# EAGLE schematic fc-carrier (EAGLE 5.09)
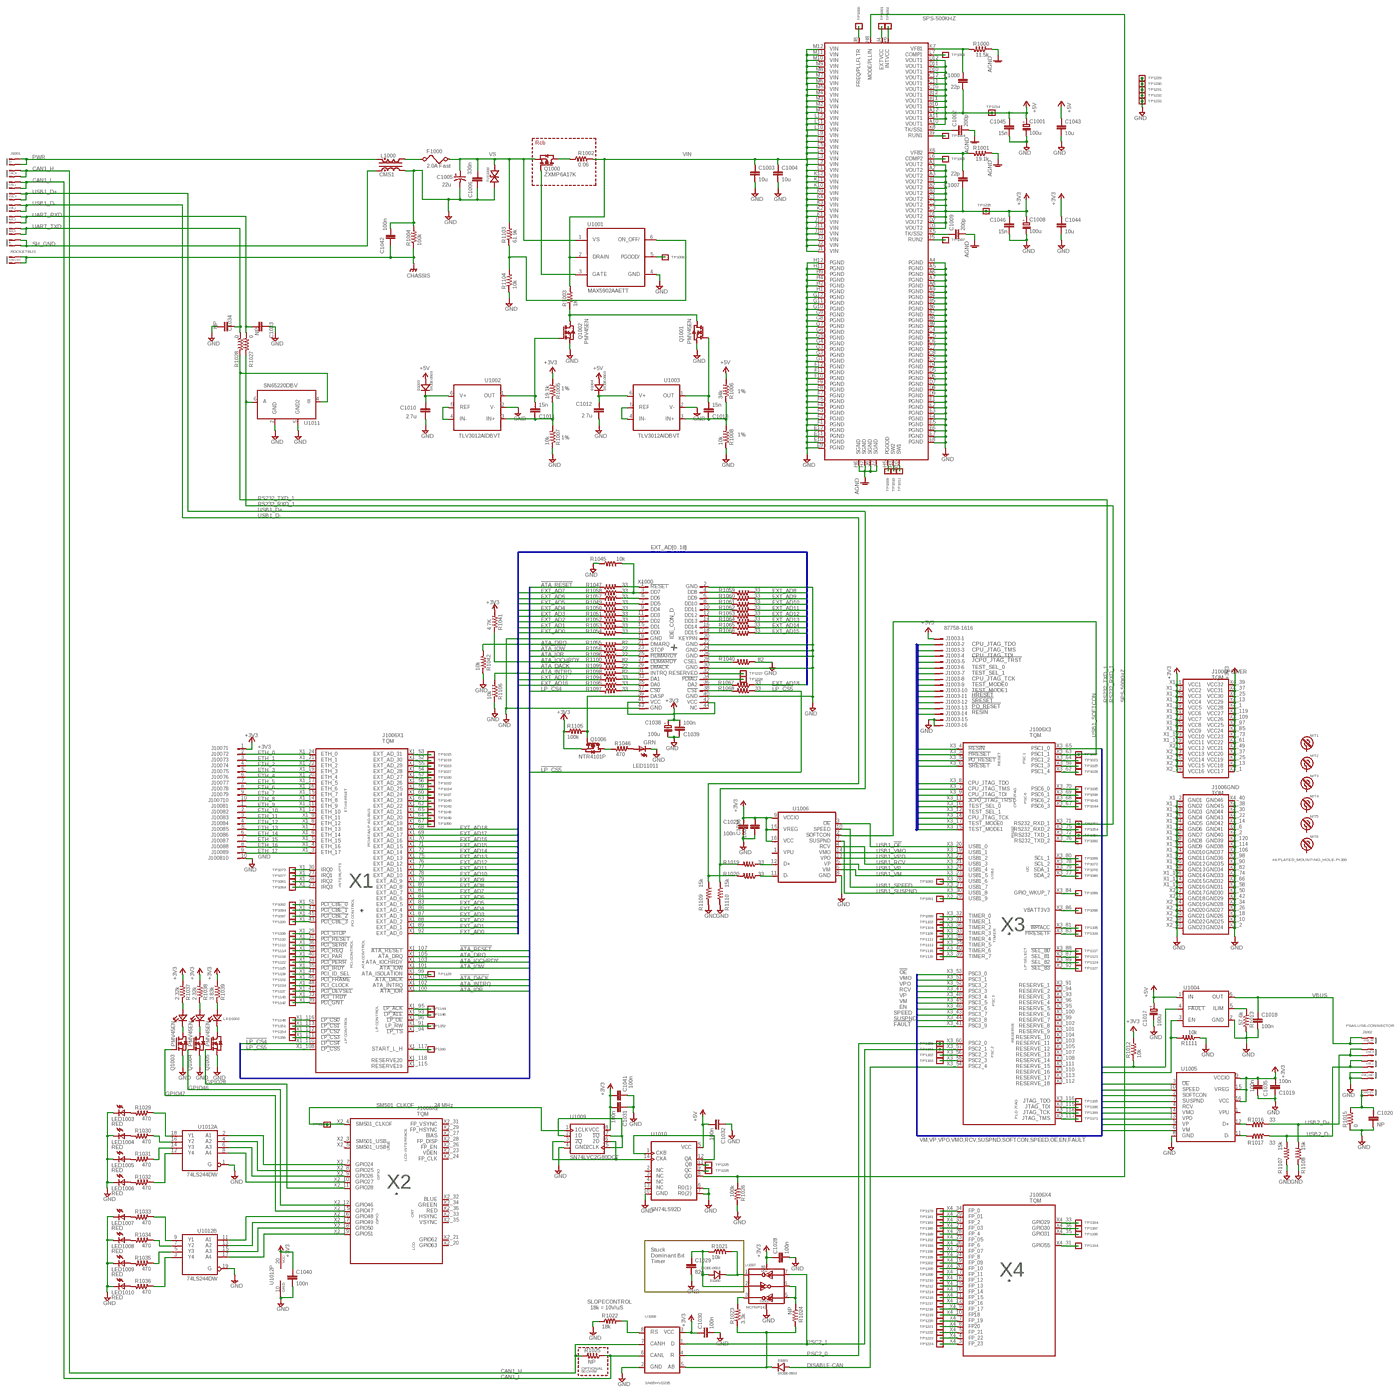
[diagram p0: schematic, sheet 1, overview]
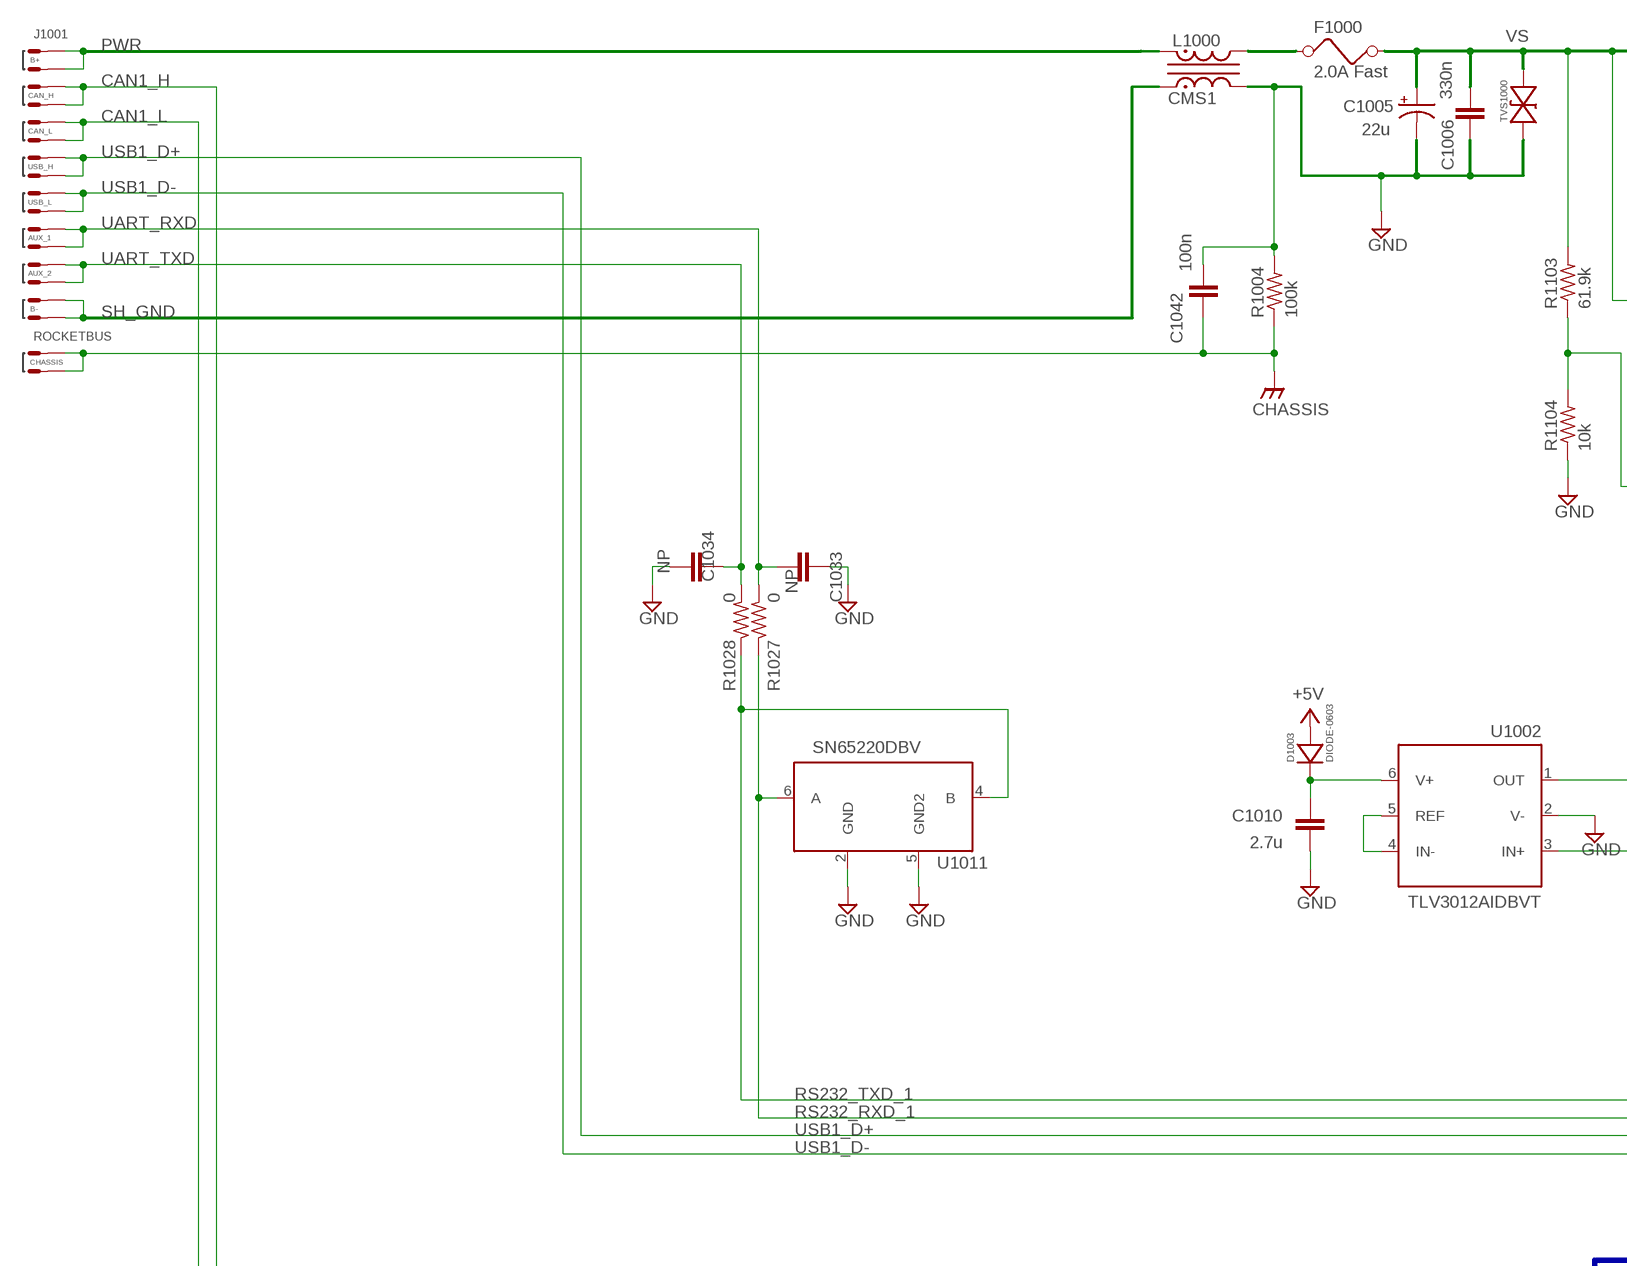
[diagram p1: schematic, sheet 1, part 1 of 4]
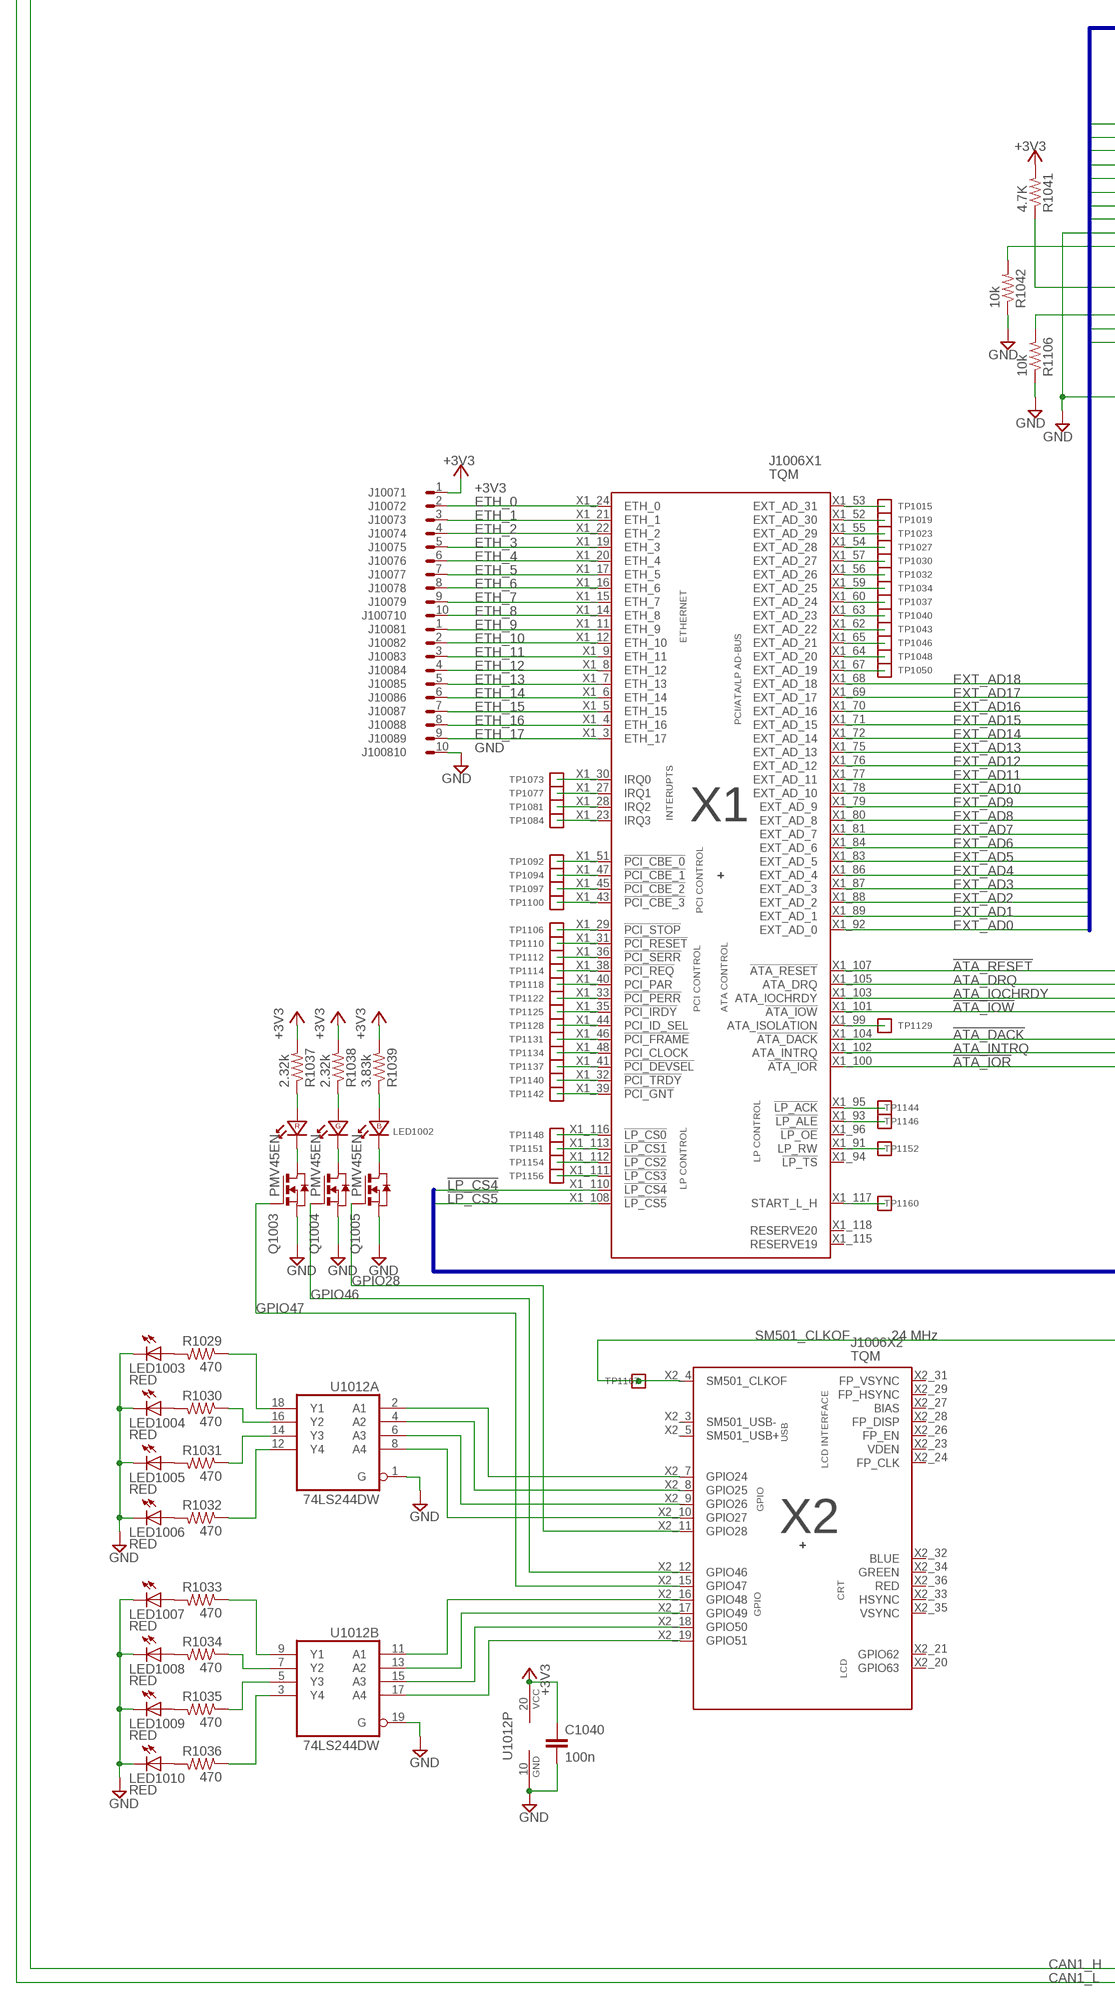
[diagram p2: schematic, sheet 1, part 2 of 4]
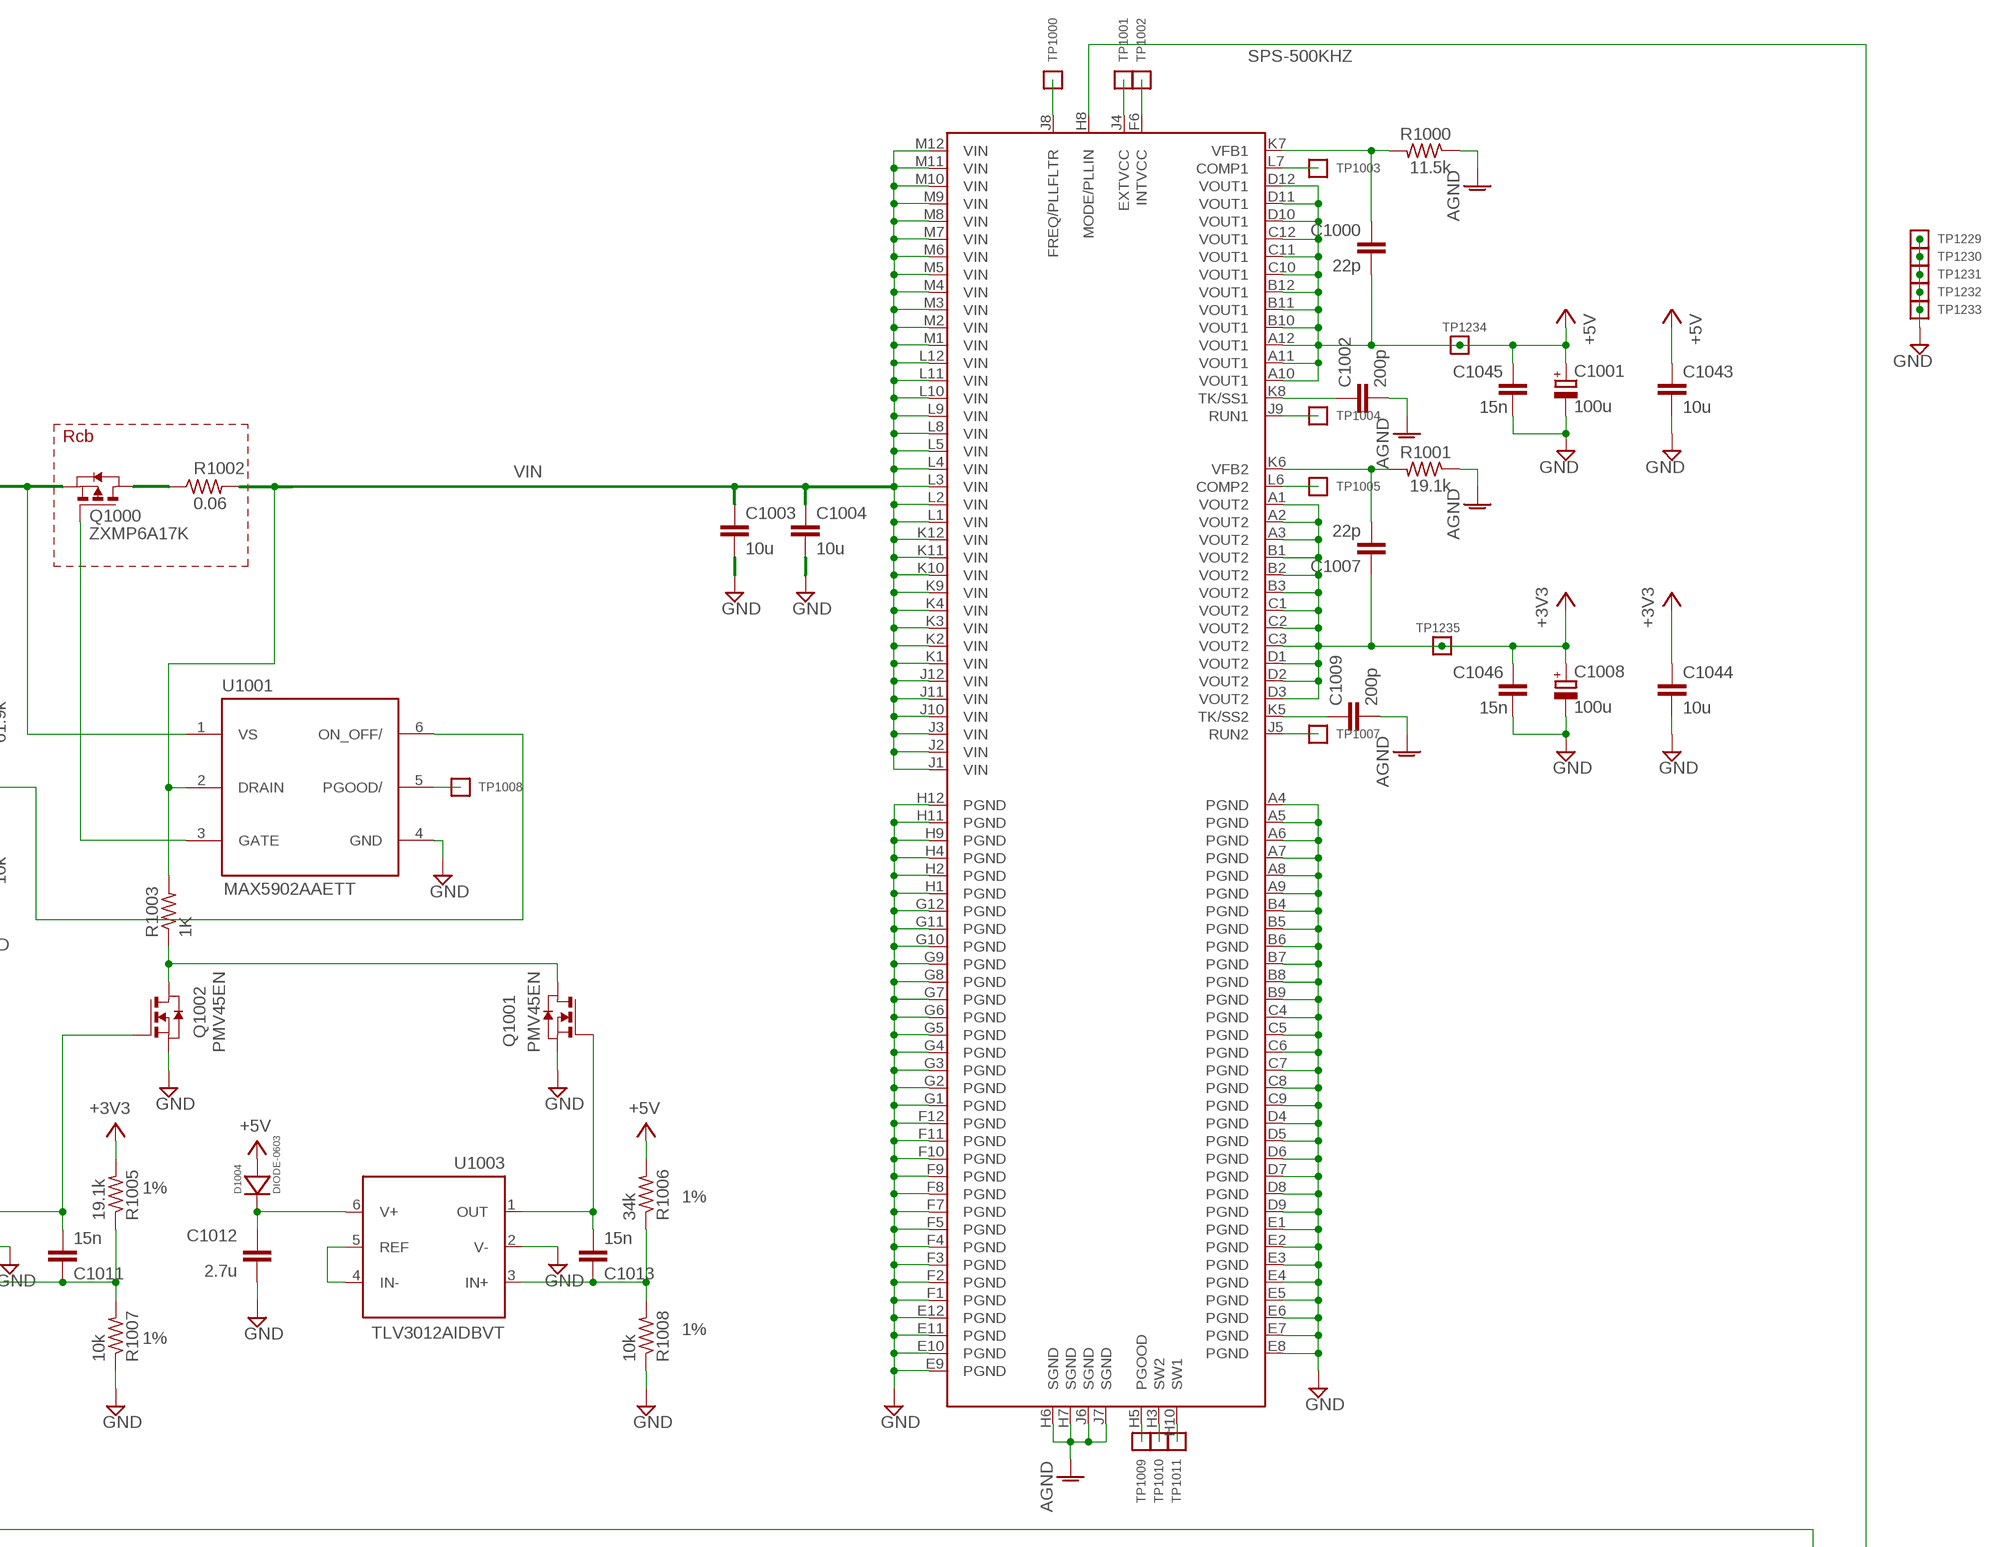
[diagram p3: schematic, sheet 1, part 3 of 4]
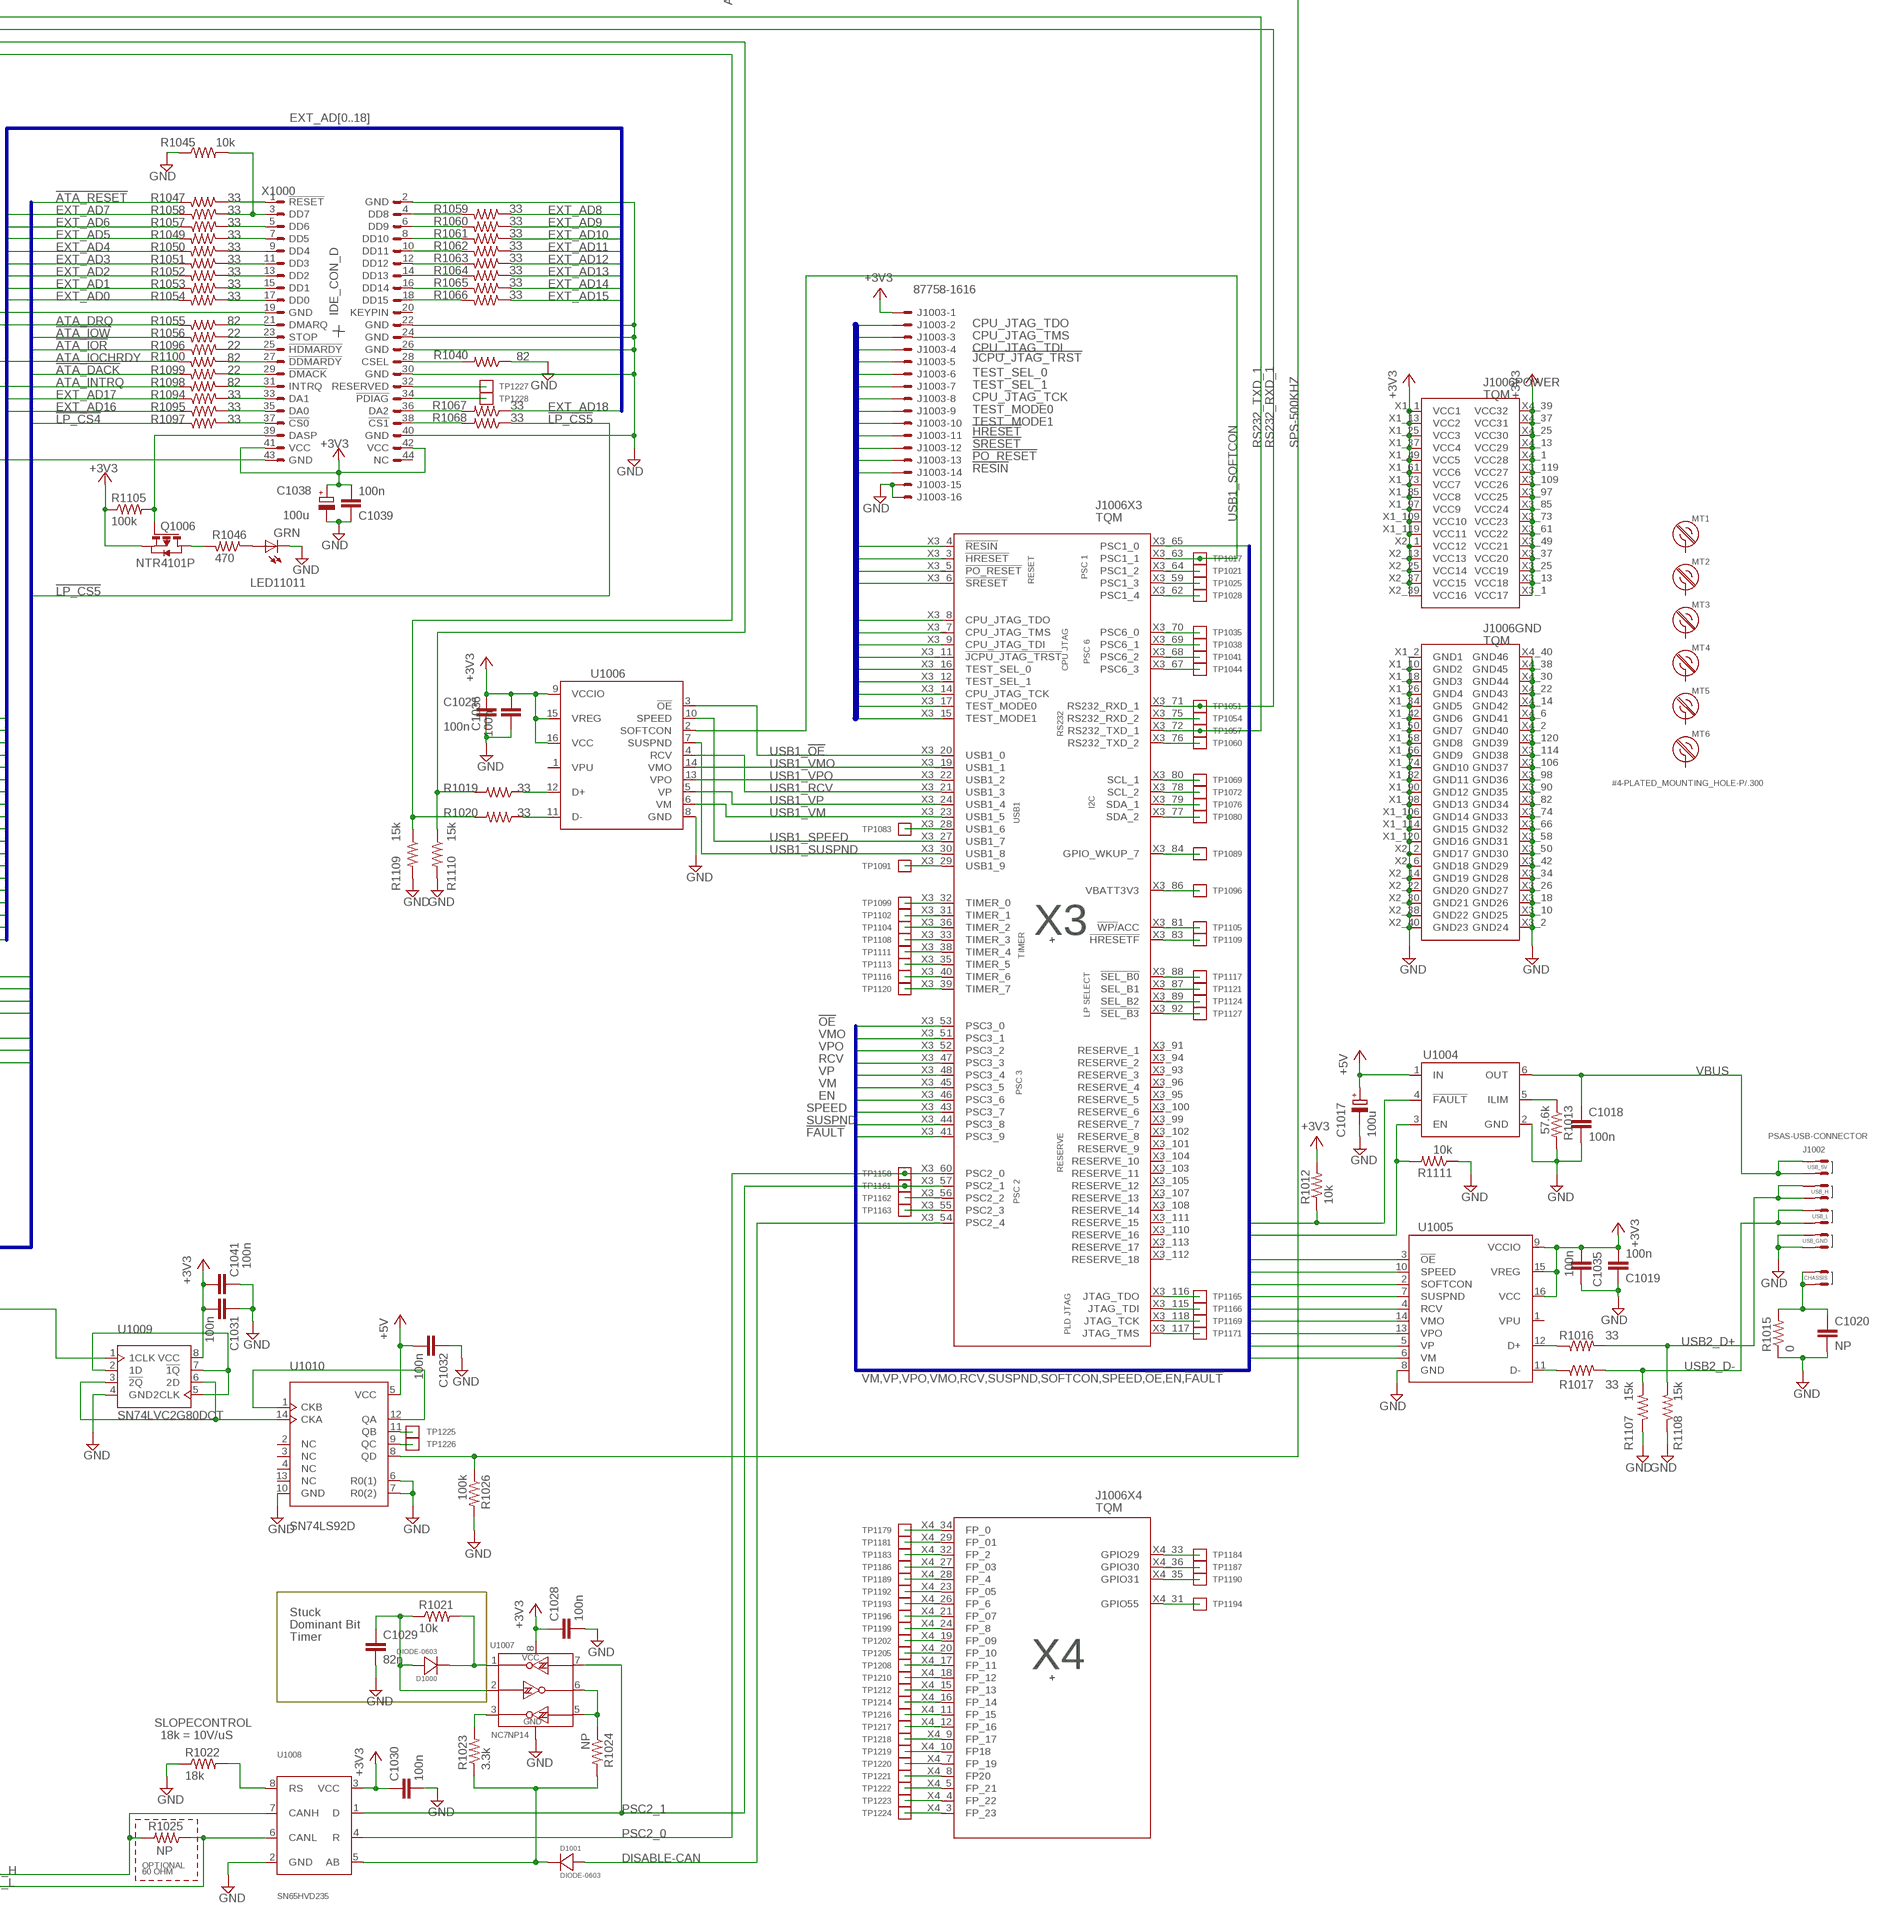
[diagram p4: schematic, sheet 1, part 4 of 4]

## Parts
C1000  22p  C-EU0603-B-NOSILK  [0603-B-NOSILK]
C1001  100u  CPOL-EUD/7343-31R  [D/7343-31R]
C1002  200p  C-EU0603-B-NOSILK  [0603-B-NOSILK]
C1003  10u  C-EU0805-B-NOSILK  [0805-B-NOSILK]
C1004  10u  C-EU0805-B-NOSILK  [0805-B-NOSILK]
C1005  22u  CPOL-USD/7343-31R  [D/7343-31R]
C1006  330n  C-EU0805-B-NOSILK  [0805-B-NOSILK]
C1007  22p  C-EU0603-B-NOSILK  [0603-B-NOSILK]
C1008  100u  CPOL-EUD/7343-31R  [D/7343-31R]
C1009  200p  C-EU0603-B-NOSILK  [0603-B-NOSILK]
C1010  2.7u  C-EU0603-B-NOSILK  [0603-B-NOSILK]
C1011  15n  C-EU0603-B-NOSILK  [0603-B-NOSILK]
C1012  2.7u  C-EU0603-B-NOSILK  [0603-B-NOSILK]
C1013  15n  C-EU0603-B-NOSILK  [0603-B-NOSILK]
C1017  100u  CPOL-EUD/7343-31R  [D/7343-31R]
C1018  100n  C-EU0603-B-NOSILK  [0603-B-NOSILK]
C1019  100n  C-EU0603-B-NOSILK  [0603-B-NOSILK]
C1020  NP  C-EU0603-B-NOSILK  [0603-B-NOSILK]
C1021  100n  C-EU0603-B-NOSILK  [0603-B-NOSILK]
C1028  100n  C-EU0603-B-NOSILK  [0603-B-NOSILK]
C1029  82n  C-EU0603-B-NOSILK  [0603-B-NOSILK]
C1030  100n  C-EU0603-B-NOSILK  [0603-B-NOSILK]
C1031  100n  C-EU0603-B-NOSILK  [0603-B-NOSILK]
C1032  100n  C-EU0603-B-NOSILK  [0603-B-NOSILK]
C1033  NP  C-EU0603-B-NOSILK  [0603-B-NOSILK]
C1034  NP  C-EU0603-B-NOSILK  [0603-B-NOSILK]
C1035  100n  C-EU0603-B-NOSILK  [0603-B-NOSILK]
C1036  100n  C-EU0603-B-NOSILK  [0603-B-NOSILK]
C1038  100u  CPOL-EUD/7343-31R  [D/7343-31R]
C1039  100n  C-EU0603-B-NOSILK  [0603-B-NOSILK]
C1040  100n  C-EU0603-B-NOSILK  [0603-B-NOSILK]
C1041  100n  C-EU0603-B-NOSILK  [0603-B-NOSILK]
C1042  100n  C-EU0603-B-NOSILK  [0603-B-NOSILK]
C1043  10u  C-EU0805-B-NOSILK  [0805-B-NOSILK]
C1044  10u  C-EU0805-B-NOSILK  [0805-B-NOSILK]
C1045  15n  C-EU0603-B-NOSILK  [0603-B-NOSILK]
C1046  15n  C-EU0603-B-NOSILK  [0603-B-NOSILK]
D1000  DIODE-0603  [0603-B-NOSILK-DIODE]
D1001  DIODE-0603  [0603-B-NOSILK-DIODE]
D1003  DIODE-0603  [0603-B-NOSILK-DIODE]
D1004  DIODE-0603  [0603-B-NOSILK-DIODE]
F1000  2.0A Fast  FUSE1206  [1206]
J1001  ROCKETBUS  [ROCKETBUS-PKG]
J1002  PSAS-USB-CONNECTOR  [USB-CONNECTOR-PKG]
J1003  87758-1616  [87758-1616]
J1006  TQM  [TQM]
J1007  1_10_CON  [1_10_CON]
J1008  1_10_CON  [1_10_CON]
L1000  CMS1  COIL_CMS1  [CMS1]
LED1002  RGB  LED_RGB_PLCC-6  [PLCC-6]
LED1003  RED  LEDCHIPLED_0603  [CHIPLED_0603]
LED1004  RED  LEDCHIPLED_0603  [CHIPLED_0603]
LED1005  RED  LEDCHIPLED_0603  [CHIPLED_0603]
LED1006  RED  LEDCHIPLED_0603  [CHIPLED_0603]
LED1007  RED  LEDCHIPLED_0603  [CHIPLED_0603]
LED1008  RED  LEDCHIPLED_0603  [CHIPLED_0603]
LED1009  RED  LEDCHIPLED_0603  [CHIPLED_0603]
LED1010  RED  LEDCHIPLED_0603  [CHIPLED_0603]
LED11011  GRN  LEDCHIPLED_0603  [CHIPLED_0603]
MT1  #4-PLATED_MOUNTING_HOLE-P/.300  [#4/.225-PAD+HEAD_OR_SMALL_NUT]
MT2  #4-PLATED_MOUNTING_HOLE-P/.300  [#4/.225-PAD+HEAD_OR_SMALL_NUT]
MT3  #4-PLATED_MOUNTING_HOLE-P/.300  [#4/.225-PAD+HEAD_OR_SMALL_NUT]
MT4  #4-PLATED_MOUNTING_HOLE-P/.300  [#4/.225-PAD+HEAD_OR_SMALL_NUT]
MT5  #4-PLATED_MOUNTING_HOLE-P/.300  [#4/.225-PAD+HEAD_OR_SMALL_NUT]
MT6  #4-PLATED_MOUNTING_HOLE-P/.300  [#4/.225-PAD+HEAD_OR_SMALL_NUT]
Q1000  ZXMP6A17K  [DPAK-ZETEX]
Q1001  PMV45EN  [SOT23]
Q1002  PMV45EN  [SOT23]
Q1003  PMV45EN  [SOT23]
Q1004  PMV45EN  [SOT23]
Q1005  PMV45EN  [SOT23]
Q1006  NTR4101P  [SOT23]
R1000  11.5k  R-US_0603-B-NOSILK  [0603-B-NOSILK]
R1001  19.1k  R-US_0603-B-NOSILK  [0603-B-NOSILK]
R1002  0.06  R-US_0805-B-NOSILK  [0805-B-NOSILK]
R1003  1K  R-US_0603-B-NOSILK  [0603-B-NOSILK]
R1004  100k  R-US_0603-B-NOSILK  [0603-B-NOSILK]
R1005  19.1k  R-US_0603-B-NOSILK  [0603-B-NOSILK]
R1006  34k  R-US_0603-B-NOSILK  [0603-B-NOSILK]
R1007  10k  R-US_0603-B-NOSILK  [0603-B-NOSILK]
R1008  10k  R-US_0603-B-NOSILK  [0603-B-NOSILK]
R1012  10k  R-US_0603-B-NOSILK  [0603-B-NOSILK]
R1013  57.6k  R-US_0603-B-NOSILK  [0603-B-NOSILK]
R1015  0  R-US_0603-B-NOSILK  [0603-B-NOSILK]
R1016  33  R-US_0603-B-NOSILK  [0603-B-NOSILK]
R1017  33  R-US_0603-B-NOSILK  [0603-B-NOSILK]
R1019  33  R-US_0603-B-NOSILK  [0603-B-NOSILK]
R1020  33  R-US_0603-B-NOSILK  [0603-B-NOSILK]
R1021  10k  R-US_0603-B-NOSILK  [0603-B-NOSILK]
R1022  18k  R-US_0603-B-NOSILK  [0603-B-NOSILK]
R1023  3.3k  R-US_0603-B-NOSILK  [0603-B-NOSILK]
R1024  NP  R-US_0603-B-NOSILK  [0603-B-NOSILK]
R1025  NP  R-US_0603-B-NOSILK  [0603-B-NOSILK]
R1026  100k  R-US_0603-B-NOSILK  [0603-B-NOSILK]
R1027  0  R-US_0603-B-NOSILK  [0603-B-NOSILK]
R1028  0  R-US_0603-B-NOSILK  [0603-B-NOSILK]
R1029  470  R-US_0603-B-NOSILK  [0603-B-NOSILK]
R1030  470  R-US_0603-B-NOSILK  [0603-B-NOSILK]
R1031  470  R-US_0603-B-NOSILK  [0603-B-NOSILK]
R1032  470  R-US_0603-B-NOSILK  [0603-B-NOSILK]
R1033  470  R-US_0603-B-NOSILK  [0603-B-NOSILK]
R1034  470  R-US_0603-B-NOSILK  [0603-B-NOSILK]
R1035  470  R-US_0603-B-NOSILK  [0603-B-NOSILK]
R1036  470  R-US_0603-B-NOSILK  [0603-B-NOSILK]
R1037  2.32k  R-US_0603-B-NOSILK  [0603-B-NOSILK]
R1038  2.32k  R-US_0603-B-NOSILK  [0603-B-NOSILK]
R1039  3.83k  R-US_0603-B-NOSILK  [0603-B-NOSILK]
R1040  82  R-US_0603-B-NOSILK  [0603-B-NOSILK]
R1041  4.7K  R-US_0603-B-NOSILK  [0603-B-NOSILK]
R1042  10k  R-US_0603-B-NOSILK  [0603-B-NOSILK]
R1045  10k  R-US_0603-B-NOSILK  [0603-B-NOSILK]
R1046  470  R-US_0603-B-NOSILK  [0603-B-NOSILK]
R1047  33  R-US_0603-B-NOSILK  [0603-B-NOSILK]
R1049  33  R-US_0603-B-NOSILK  [0603-B-NOSILK]
R1050  33  R-US_0603-B-NOSILK  [0603-B-NOSILK]
R1051  33  R-US_0603-B-NOSILK  [0603-B-NOSILK]
R1052  33  R-US_0603-B-NOSILK  [0603-B-NOSILK]
R1053  33  R-US_0603-B-NOSILK  [0603-B-NOSILK]
R1054  33  R-US_0603-B-NOSILK  [0603-B-NOSILK]
R1055  82  R-US_0603-B-NOSILK  [0603-B-NOSILK]
R1056  22  R-US_0603-B-NOSILK  [0603-B-NOSILK]
R1057  33  R-US_0603-B-NOSILK  [0603-B-NOSILK]
R1058  33  R-US_0603-B-NOSILK  [0603-B-NOSILK]
R1059  33  R-US_0603-B-NOSILK  [0603-B-NOSILK]
R1060  33  R-US_0603-B-NOSILK  [0603-B-NOSILK]
R1061  33  R-US_0603-B-NOSILK  [0603-B-NOSILK]
R1062  33  R-US_0603-B-NOSILK  [0603-B-NOSILK]
R1063  33  R-US_0603-B-NOSILK  [0603-B-NOSILK]
R1064  33  R-US_0603-B-NOSILK  [0603-B-NOSILK]
R1065  33  R-US_0603-B-NOSILK  [0603-B-NOSILK]
R1066  33  R-US_0603-B-NOSILK  [0603-B-NOSILK]
R1067  33  R-US_0603-B-NOSILK  [0603-B-NOSILK]
R1068  33  R-US_0603-B-NOSILK  [0603-B-NOSILK]
R1094  33  R-US_0603-B-NOSILK  [0603-B-NOSILK]
R1095  33  R-US_0603-B-NOSILK  [0603-B-NOSILK]
R1096  22  R-US_0603-B-NOSILK  [0603-B-NOSILK]
R1097  33  R-US_0603-B-NOSILK  [0603-B-NOSILK]
R1098  82  R-US_0603-B-NOSILK  [0603-B-NOSILK]
R1099  22  R-US_0603-B-NOSILK  [0603-B-NOSILK]
R1100  82  R-US_0603-B-NOSILK  [0603-B-NOSILK]
R1103  61.9k  R-US_0603-B-NOSILK  [0603-B-NOSILK]
R1104  10k  R-US_0603-B-NOSILK  [0603-B-NOSILK]
R1105  100k  R-US_0603-B-NOSILK  [0603-B-NOSILK]
R1106  10k  R-US_0603-B-NOSILK  [0603-B-NOSILK]
R1107  15k  R-US_0603-B-NOSILK  [0603-B-NOSILK]
R1108  15k  R-US_0603-B-NOSILK  [0603-B-NOSILK]
R1109  15k  R-US_0603-B-NOSILK  [0603-B-NOSILK]
R1110  15k  R-US_0603-B-NOSILK  [0603-B-NOSILK]
R1111  10k  R-US_0603-B-NOSILK  [0603-B-NOSILK]
TP1000  TEST  [TEST]
TP1001  TEST  [TEST]
TP1002  TEST  [TEST]
TP1003  TEST  [TEST]
TP1004  TEST  [TEST]
TP1005  TEST  [TEST]
TP1007  TEST  [TEST]
TP1008  TEST  [TEST]
TP1009  TEST  [TEST]
TP1010  TEST  [TEST]
TP1011  TEST  [TEST]
TP1015  TEST  [TEST]
TP1017  TEST  [TEST]
TP1019  TEST  [TEST]
TP1021  TEST  [TEST]
TP1023  TEST  [TEST]
TP1025  TEST  [TEST]
TP1027  TEST  [TEST]
TP1028  TEST  [TEST]
TP1030  TEST  [TEST]
TP1032  TEST  [TEST]
TP1034  TEST  [TEST]
TP1035  TEST  [TEST]
TP1037  TEST  [TEST]
TP1038  TEST  [TEST]
TP1040  TEST  [TEST]
TP1041  TEST  [TEST]
TP1043  TEST  [TEST]
TP1044  TEST  [TEST]
TP1046  TEST  [TEST]
TP1048  TEST  [TEST]
TP1050  TEST  [TEST]
TP1051  TEST  [TEST]
TP1054  TEST  [TEST]
TP1057  TEST  [TEST]
TP1060  TEST  [TEST]
TP1069  TEST  [TEST]
TP1072  TEST  [TEST]
TP1073  TEST  [TEST]
TP1076  TEST  [TEST]
TP1077  TEST  [TEST]
TP1080  TEST  [TEST]
TP1081  TEST  [TEST]
TP1083  TEST  [TEST]
TP1084  TEST  [TEST]
TP1089  TEST  [TEST]
TP1091  TEST  [TEST]
TP1092  TEST  [TEST]
TP1094  TEST  [TEST]
TP1096  TEST  [TEST]
TP1097  TEST  [TEST]
TP1099  TEST  [TEST]
TP1100  TEST  [TEST]
TP1102  TEST  [TEST]
TP1104  TEST  [TEST]
TP1105  TEST  [TEST]
TP1106  TEST  [TEST]
TP1108  TEST  [TEST]
TP1109  TEST  [TEST]
TP1110  TEST  [TEST]
TP1111  TEST  [TEST]
TP1112  TEST  [TEST]
TP1113  TEST  [TEST]
TP1114  TEST  [TEST]
TP1116  TEST  [TEST]
TP1117  TEST  [TEST]
TP1118  TEST  [TEST]
TP1120  TEST  [TEST]
TP1121  TEST  [TEST]
TP1122  TEST  [TEST]
TP1124  TEST  [TEST]
TP1125  TEST  [TEST]
TP1127  TEST  [TEST]
TP1128  TEST  [TEST]
TP1129  TEST  [TEST]
TP1131  TEST  [TEST]
TP1134  TEST  [TEST]
TP1137  TEST  [TEST]
TP1140  TEST  [TEST]
TP1142  TEST  [TEST]
TP1144  TEST  [TEST]
TP1146  TEST  [TEST]
TP1148  TEST  [TEST]
TP1151  TEST  [TEST]
TP1152  TEST  [TEST]
TP1154  TEST  [TEST]
TP1156  TEST  [TEST]
TP1158  TEST  [TEST]
TP1160  TEST  [TEST]
TP1161  TEST  [TEST]
TP1162  TEST  [TEST]
TP1163  TEST  [TEST]
TP1165  TEST  [TEST]
TP1166  TEST  [TEST]
TP1167  TEST  [TEST]
TP1169  TEST  [TEST]
TP1171  TEST  [TEST]
TP1179  TEST  [TEST]
TP1181  TEST  [TEST]
TP1183  TEST  [TEST]
TP1184  TEST  [TEST]
TP1186  TEST  [TEST]
TP1187  TEST  [TEST]
TP1189  TEST  [TEST]
TP1190  TEST  [TEST]
TP1192  TEST  [TEST]
TP1193  TEST  [TEST]
TP1194  TEST  [TEST]
TP1196  TEST  [TEST]
TP1199  TEST  [TEST]
TP1202  TEST  [TEST]
TP1205  TEST  [TEST]
TP1208  TEST  [TEST]
TP1210  TEST  [TEST]
TP1212  TEST  [TEST]
TP1214  TEST  [TEST]
TP1216  TEST  [TEST]
TP1217  TEST  [TEST]
TP1218  TEST  [TEST]
TP1219  TEST  [TEST]
TP1220  TEST  [TEST]
TP1221  TEST  [TEST]
TP1222  TEST  [TEST]
TP1223  TEST  [TEST]
TP1224  TEST  [TEST]
TP1225  TEST  [TEST]
TP1226  TEST  [TEST]
TP1227  TEST  [TEST]
TP1228  TEST  [TEST]
TP1229  TEST  [TEST]
TP1230  TEST  [TEST]
TP1231  TEST  [TEST]
TP1232  TEST  [TEST]
TP1233  TEST  [TEST]
TP1234  TEST  [TEST]
TP1235  TEST  [TEST]
TVS1000  TVS-0603  [0603-B-NOSILK-DIODE]
U1000  LT4619  [LT4619]
U1001  MAX5902AAETT  IC_MAX5902  [SOT23-6]
U1002  TLV3012AIDBVT  IC_TLV3012  [SOT23-6]
U1003  TLV3012AIDBVT  IC_TLV3012  [SOT23-6]
U1004  TPS2552SOP  [USB_PWR_SWT_SOP]
U1005  TUSB1106TSSOP  [USB_TRANCEIVER]
U1006  TUSB1106TSSOP  [USB_TRANCEIVER]
U1007  NC7NP14  IC_NC7NP14  [MICROPAK-8]
U1008  SN65HVD235  [DR-PDSO-G8]
U1009  SN74LVC2G80DCT  [DCT-SSOP]
U1010  SN74LS92D  [TI-D-SSOIC]
U1011  SN65220DBV  [SOT23-6L]
U1012  74LS244DW  [SO20W]
X1000  IDE_CON_D  [IDE_CON_P]

## Nets
!ATA_DACK: J1006.X1_104(X1:!ATA_DACK) R1099.2
!ATA_IOR: J1006.X1_100(X1:!ATA_IOR) R1096.1
!ATA_IOW: J1006.X1_101(X1:!ATA_IOW) R1056.2
!ATA_RESET: J1006.X1_107(X1:!ATA_RESET) R1047.2
!CS0: J1006.X3_32(X3:TIMER_0) TP1099.P$1
!CS1: J1006.X3_31(X3:TIMER_1) TP1102.P$1
!FAULT: J1006.X3_41(X3:PSC3_9) R1012.1 U1004.4(!FAULT)
!HRESET: J1003.11 J1006.X3_3(X3:!HRESET)
!JCPU_JTAG_TRST: J1003.5 J1006.X3_11(X3:!JCPU_JTAG_TRST)
!LP_CS4: J1006.X1_110(X1:!LP_CS4) R1097.1
!LP_CS5: J1006.X1_108(X1:!LP_CS5) R1068.1
!OE: J1006.X3_53(X3:PSC3_0) U1005.3(!OE)
!PO_RESET: J1003.13 J1006.X3_5(X3:!PO_RESET)
!RESIN: J1003.14 J1006.X3_4(X3:!RESIN)
!SRESET: J1003.12 J1006.X3_6(X3:!SRESET)
+3V3: C1007.1 C1008.+ C1019.2 C1021.2 C1028.1 C1030.1 C1031.2 C1035.1 C1036.1 C1038.+ C1039.2 C1040.1 C1041.2 C1044.1 C1046.1 J1003.1 J1006.X1_1(POWER:VCC1) J1006.X1_13(POWER:VCC2) J1006.X1_25(POWER:VCC3) J1006.X1_37(POWER:VCC4) J1006.X1_49(POWER:VCC5) J1006.X1_61(POWER:VCC6) J1006.X1_73(POWER:VCC7) J1006.X1_85(POWER:VCC8) J1006.X1_97(POWER:VCC9) J1006.X1_109(POWER:VCC10) J1006.X1_119(POWER:VCC11) J1006.X2_1(POWER:VCC12) J1006.X2_13(POWER:VCC13) J1006.X2_25(POWER:VCC14) J1006.X2_37(POWER:VCC15) J1006.X2_39(POWER:VCC16) J1006.X3_1(POWER:VCC17) J1006.X3_13(POWER:VCC18) J1006.X3_25(POWER:VCC19) J1006.X3_37(POWER:VCC20) J1006.X3_49(POWER:VCC21) J1006.X3_61(POWER:VCC22) J1006.X3_73(POWER:VCC23) J1006.X3_85(POWER:VCC24) J1006.X3_97(POWER:VCC25) J1006.X3_109(POWER:VCC26) J1006.X3_119(POWER:VCC27) J1006.X4_1(POWER:VCC28) J1006.X4_13(POWER:VCC29) J1006.X4_25(POWER:VCC30) J1006.X4_37(POWER:VCC31) J1006.X4_39(POWER:VCC32) J1007.1 Q1006.2(S) R1005.2 R1012.2 R1037.2 R1038.2 R1039.2 R1041.2 R1105.1 TP1235.P$1 U1000.A1(VOUT2) U1000.A2(VOUT2) U1000.A3(VOUT2) U1000.B1(VOUT2) U1000.B2(VOUT2) U1000.B3(VOUT2) U1000.C1(VOUT2) U1000.C2(VOUT2) U1000.C3(VOUT2) U1000.D1(VOUT2) U1000.D2(VOUT2) U1000.D3(VOUT2) U1005.9(VCCIO) U1005.15(VREG) U1005.16(VCC) U1006.9(VCCIO) U1006.15(VREG) U1006.16(VCC) U1007.8(VCC) U1008.3(VCC) U1009.8(VCC) U1012.20(P:VCC) X1000.41(VCC) X1000.42(VCC)
+5V: C1000.2 C1001.+ C1017.+ C1032.2 C1043.1 C1045.1 D1003.ANODE D1004.ANODE R1006.2 TP1234.P$1 U1000.A10(VOUT1) U1000.A11(VOUT1) U1000.A12(VOUT1) U1000.B10(VOUT1) U1000.B11(VOUT1) U1000.B12(VOUT1) U1000.C10(VOUT1) U1000.C11(VOUT1) U1000.C12(VOUT1) U1000.D10(VOUT1) U1000.D11(VOUT1) U1000.D12(VOUT1) U1004.1(IN) U1010.5(VCC)
ACT_SIGNAL: Q1006.1(G) R1105.2 X1000.39(DASP)
AGND: C1002.2 C1009.2 R1000.1 R1001.1 U1000.H6(SGND) U1000.H7(SGND) U1000.J6(SGND) U1000.J7(SGND)
ATA_DRQ: J1006.X1_105(X1:ATA_DRQ) R1042.2 R1055.2
ATA_INTRQ: J1006.X1_102(X1:ATA_INTRQ) R1098.2 R1106.2
ATA_IOCHRDY: J1006.X1_103(X1:ATA_IOCHRDY) R1041.1 R1100.2
BIN: F1000.1 L1000.3
CAN1_H: J1001.CAN_H@1(CAN_H) J1001.CAN_H@2(CAN_H) R1025.2 U1008.7(CANH)
CAN1_L: J1001.CAN_L@1(CAN_L) J1001.CAN_L@2(CAN_L) R1025.1 U1008.6(CANL)
CHASSIS: C1042.1 J1001.CHASSIS@1(CHASSIS) J1001.CHASSIS@2(CHASSIS) R1004.1
CPU_JTAG_TCK: J1003.8 J1006.X3_14(X3:CPU_JTAG_TCK)
CPU_JTAG_TDI: J1003.4 J1006.X3_9(X3:CPU_JTAG_TDI)
CPU_JTAG_TDO: J1003.2 J1006.X3_8(X3:CPU_JTAG_TDO)
CPU_JTAG_TMS: J1003.3 J1006.X3_7(X3:CPU_JTAG_TMS)
DISABLE-CAN: D1001.ANODE J1006.X3_54(X3:PSC2_4)
DOMINANT_BIT_STUCK_WHEN_HIGH: C1029.1 D1000.ANODE R1021.1 U1007.2(3A)
EN: J1006.X3_46(X3:PSC3_6) R1111.2 U1004.3(EN)
ETH_0: J1006.X1_24(X1:ETH_0) J1007.2
ETH_1: J1006.X1_21(X1:ETH_1) J1007.3
ETH_2: J1006.X1_22(X1:ETH_2) J1007.4
ETH_3: J1006.X1_19(X1:ETH_3) J1007.5
ETH_4: J1006.X1_20(X1:ETH_4) J1007.6
ETH_5: J1006.X1_17(X1:ETH_5) J1007.7
ETH_6: J1006.X1_16(X1:ETH_6) J1007.8
ETH_7: J1006.X1_15(X1:ETH_7) J1007.9
ETH_8: J1006.X1_14(X1:ETH_8) J1007.10
ETH_9: J1006.X1_11(X1:ETH_9) J1008.1
ETH_10: J1006.X1_12(X1:ETH_10) J1008.2
ETH_11: J1006.X1_9(X1:ETH_11) J1008.3
ETH_12: J1006.X1_8(X1:ETH_12) J1008.4
ETH_13: J1006.X1_7(X1:ETH_13) J1008.5
ETH_14: J1006.X1_6(X1:ETH_14) J1008.6
ETH_15: J1006.X1_5(X1:ETH_15) J1008.7
ETH_16: J1006.X1_4(X1:ETH_16) J1008.8
ETH_17: J1006.X1_3(X1:ETH_17) J1008.9
EXT_AD0: J1006.X1_92(X1:EXT_AD_0) R1054.2
EXT_AD1: J1006.X1_89(X1:EXT_AD_1) R1053.2
EXT_AD2: J1006.X1_88(X1:EXT_AD_2) R1052.2
EXT_AD3: J1006.X1_87(X1:EXT_AD_3) R1051.2
EXT_AD4: J1006.X1_86(X1:EXT_AD_4) R1050.2
EXT_AD5: J1006.X1_83(X1:EXT_AD_5) R1049.2
EXT_AD6: J1006.X1_84(X1:EXT_AD_6) R1057.1
EXT_AD7: J1006.X1_81(X1:EXT_AD_7) R1058.1
EXT_AD8: J1006.X1_80(X1:EXT_AD_8) R1059.1
EXT_AD9: J1006.X1_79(X1:EXT_AD_9) R1060.1
EXT_AD10: J1006.X1_78(X1:EXT_AD_10) R1061.1
EXT_AD11: J1006.X1_77(X1:EXT_AD_11) R1062.1
EXT_AD12: J1006.X1_76(X1:EXT_AD_12) R1063.1
EXT_AD13: J1006.X1_75(X1:EXT_AD_13) R1064.1
EXT_AD14: J1006.X1_72(X1:EXT_AD_14) R1065.1
EXT_AD15: J1006.X1_71(X1:EXT_AD_15) R1066.1
EXT_AD16: J1006.X1_70(X1:EXT_AD_16) R1095.1
EXT_AD17: J1006.X1_69(X1:EXT_AD_17) R1094.1
EXT_AD18: J1006.X1_68(X1:EXT_AD_18) R1067.1
GND: C1001.- C1003.2 C1004.2 C1005.- C1006.1 C1008.- C1010.1 C1012.1 C1017.- C1018.2 C1019.1 C1020.2 C1021.1 C1028.2 C1029.2 C1030.2 C1031.1 C1032.1 C1033.1 C1034.1 C1035.2 C1036.2 C1038.- C1039.1 C1040.2 C1041.1 C1042.2 C1043.2 C1044.2 C1045.2 C1046.2 J1002.B-@7(GND) J1002.B-@8(GND) J1003.15 J1003.16 J1006.X1_2(GND:GND1) J1006.X1_10(GND:GND2) J1006.X1_18(GND:GND3) J1006.X1_26(GND:GND4) J1006.X1_34(GND:GND5) J1006.X1_42(GND:GND6) J1006.X1_50(GND:GND7) J1006.X1_58(GND:GND8) J1006.X1_66(GND:GND9) J1006.X1_74(GND:GND10) J1006.X1_82(GND:GND11) J1006.X1_90(GND:GND12) J1006.X1_98(GND:GND13) J1006.X1_106(GND:GND14) J1006.X1_114(GND:GND15) J1006.X1_120(GND:GND16) J1006.X2_2(GND:GND17) J1006.X2_6(GND:GND18) J1006.X2_14(GND:GND19) J1006.X2_22(GND:GND20) J1006.X2_30(GND:GND21) J1006.X2_38(GND:GND22) J1006.X2_40(GND:GND23) J1006.X3_2(GND:GND24) J1006.X3_10(GND:GND25) J1006.X3_18(GND:GND26) J1006.X3_26(GND:GND27) J1006.X3_34(GND:GND28) J1006.X3_42(GND:GND29) J1006.X3_50(GND:GND30) J1006.X3_58(GND:GND31) J1006.X3_66(GND:GND32) J1006.X3_74(GND:GND33) J1006.X3_82(GND:GND34) J1006.X3_90(GND:GND35) J1006.X3_98(GND:GND36) J1006.X3_106(GND:GND37) J1006.X3_114(GND:GND38) J1006.X3_120(GND:GND39) J1006.X4_2(GND:GND40) J1006.X4_6(GND:GND41) J1006.X4_14(GND:GND42) J1006.X4_22(GND:GND43) J1006.X4_30(GND:GND44) J1006.X4_38(GND:GND45) J1006.X4_40(GND:GND46) J1008.10 L1000.2 LED1003.C LED1004.C LED1005.C LED1006.C LED1007.C LED1008.C LED1009.C LED1010.C LED11011.C Q1001.2(S) Q1002.2(S) Q1003.2(S) Q1004.2(S) Q1005.2(S) R1004.2 R1007.1 R1008.1 R1013.2 R1015.1 R1022.1 R1026.2 R1040.1 R1042.1 R1045.1 R1104.1 R1106.1 R1107.1 R1108.1 R1109.2 R1110.2 R1111.1 TP1229.P$1 TP1230.P$1 TP1231.P$1 TP1232.P$1 TP1233.P$1 TVS1000.CATHODE U1000.A4(PGND) U1000.A5(PGND) U1000.A6(PGND) U1000.A7(PGND) U1000.A8(PGND) U1000.A9(PGND) U1000.B4(PGND) U1000.B5(PGND) U1000.B6(PGND) U1000.B7(PGND) U1000.B8(PGND) U1000.B9(PGND) U1000.C4(PGND) U1000.C5(PGND) U1000.C6(PGND) U1000.C7(PGND) U1000.C8(PGND) U1000.C9(PGND) U1000.D4(PGND) U1000.D5(PGND) U1000.D6(PGND) U1000.D7(PGND) U1000.D8(PGND) U1000.D9(PGND) U1000.E1(PGND) U1000.E2(PGND) U1000.E3(PGND) U1000.E4(PGND) U1000.E5(PGND) U1000.E6(PGND) U1000.E7(PGND) U1000.E8(PGND) U1000.E9(PGND) U1000.E10(PGND) U1000.E11(PGND) U1000.E12(PGND) U1000.F1(PGND) U1000.F2(PGND) U1000.F3(PGND) U1000.F4(PGND) U1000.F5(PGND) U1000.F7(PGND) U1000.F8(PGND) U1000.F9(PGND) U1000.F10(PGND) U1000.F11(PGND) U1000.F12(PGND) U1000.G1(PGND) U1000.G2(PGND) U1000.G3(PGND) U1000.G4(PGND) U1000.G5(PGND) U1000.G6(PGND) U1000.G7(PGND) U1000.G8(PGND) U1000.G9(PGND) U1000.G10(PGND) U1000.G11(PGND) U1000.G12(PGND) U1000.H1(PGND) U1000.H2(PGND) U1000.H4(PGND) U1000.H9(PGND) U1000.H11(PGND) U1000.H12(PGND) U1001.4(GND) U1002.2(V-) U1003.2(V-) U1004.2(GND) U1005.8(GND) U1006.8(GND) U1007.4(GND) U1008.2(GND) U1009.4(GND) U1010.6(R0(1)) U1010.7(R0(2)) U1010.10(GND) U1011.2(GND) U1011.5(GND2) U1012.1(A:G) U1012.10(P:GND) U1012.19(B:G) X1000.2(GND) X1000.19(GND) X1000.22(GND) X1000.24(GND) X1000.26(GND) X1000.30(GND) X1000.40(GND) X1000.43(GND)
GPIO24: J1006.X2_7(X2:GPIO24) U1012.2(A:A1)
GPIO25: J1006.X2_8(X2:GPIO25) U1012.4(A:A2)
GPIO26: J1006.X2_9(X2:GPIO26) U1012.6(A:A3)
GPIO27: J1006.X2_10(X2:GPIO27) U1012.8(A:A4)
GPIO28: J1006.X2_11(X2:GPIO28) Q1005.1(G)
GPIO46: J1006.X2_12(X2:GPIO46) Q1004.1(G)
GPIO47: J1006.X2_15(X2:GPIO47) Q1003.1(G)
GPIO48: J1006.X2_16(X2:GPIO48) U1012.11(B:A1)
GPIO49: J1006.X2_17(X2:GPIO49) U1012.13(B:A2)
GPIO50: J1006.X2_18(X2:GPIO50) U1012.15(B:A3)
GPIO51: J1006.X2_19(X2:GPIO51) U1012.17(B:A4)
ILIM: R1013.1 U1004.5(ILIM)
IN+: C1013.1 R1006.1 R1008.2 U1003.3(IN+)
IN+1: C1011.1 R1005.1 R1007.2 U1002.3(IN+)
INV-INV: R1024.1 U1007.5(2A) U1007.6(3Y)
INV_DATA: D1000.CATHODE R1021.2 U1007.1(1Y)
N$1: TP1225.P$1 U1010.11(QB)
N$2: R1033.1 U1012.9(B:Y1)
N$3: J1006.X1_91(X1:LP_RW) TP1152.P$1
N$4: J1006.X4_31(X4:GPIO55) TP1194.P$1
N$5: TP1226.P$1 U1010.9(QC)
N$6: C1020.1 J1002.CHASSIS@1(CHASSIS) J1002.CHASSIS@2(CHASSIS) R1015.2
N$7: R1034.1 U1012.7(B:Y2)
N$8: TP1001.P$1 U1000.J4(EXTVCC)
N$9: R1040.2 X1000.28(CSEL)
N$10: J1006.X4_35(X4:GPIO31) TP1190.P$1
N$11: J1006.X4_36(X4:GPIO30) TP1187.P$1
N$12: TP1004.P$1 U1000.J9(RUN1)
N$13: C1000.1 R1000.2 U1000.K7(VFB1)
N$14: J1006.X4_33(X4:GPIO29) TP1184.P$1
N$15: TP1009.P$1 U1000.H5(PGOOD)
N$16: C1002.1 U1000.K8(TK/SS1)
N$17: C1007.2 R1001.2 U1000.K6(VFB2)
N$18: C1009.1 U1000.K5(TK/SS2)
N$19: J1006.X4_34(X4:FP_0) TP1179.P$1
N$20: TP1002.P$1 U1000.F6(INTVCC)
N$21: J1006.X4_29(X4:FP_01) TP1181.P$1
N$22: J1006.X4_32(X4:FP_2) TP1183.P$1
N$23: J1006.X4_27(X4:FP_03) TP1186.P$1
N$24: J1006.X3_84(X3:GPIO_WKUP_7) TP1089.P$1
N$25: J1006.X4_28(X4:FP_4) TP1189.P$1
N$26: J1006.X4_23(X4:FP_05) TP1192.P$1
N$27: J1006.X4_26(X4:FP_6) TP1193.P$1
N$28: J1006.X4_21(X4:FP_07) TP1196.P$1
N$29: J1006.X4_24(X4:FP_8) TP1199.P$1
N$30: J1006.X4_19(X4:FP_09) TP1202.P$1
N$31: Q1000.DRAIN(D) R1002.1
N$32: R1016.1 U1005.12(D+)
N$33: R1017.1 U1005.11(D-)
N$34: J1006.X4_20(X4:FP_10) TP1205.P$1
N$35: J1006.X4_17(X4:FP_11) TP1208.P$1
N$36: J1006.X4_18(X4:FP_12) TP1210.P$1
N$37: LED1003.A R1029.2
N$38: TP1010.P$1 U1000.H3(SW2)
N$39: TP1011.P$1 U1000.H10(SW1)
N$40: U1003.4(IN-) U1003.5(REF)
N$41: J1006.X4_15(X4:FP_13) TP1212.P$1
N$42: J1006.X4_16(X4:FP_14) TP1214.P$1
N$43: J1006.X4_11(X4:FP_15) TP1216.P$1
N$44: J1006.X4_12(X4:FP_16) TP1217.P$1
N$45: J1006.X4_9(X4:FP_17) TP1218.P$1
N$46: J1006.X4_10(X4:FP18) TP1219.P$1
N$47: U1009.2(1D) U1009.5(2CLK) U1009.7(!1Q)
N$48: R1023.2 U1007.3(2Y)
N$49: J1006.X4_7(X4:FP_19) TP1220.P$1
N$50: J1006.X4_8(X4:FP20) TP1221.P$1
N$51: J1006.X4_5(X4:FP_21) TP1222.P$1
N$52: J1006.X4_4(X4:FP_22) TP1223.P$1
N$53: J1006.X4_3(X4:FP_23) TP1224.P$1
N$54: J1006.X3_117(X3:JTAG_TMS) TP1171.P$1
N$55: J1006.X3_118(X3:JTAG_TCK) TP1169.P$1
N$56: J1006.X3_115(X3:JTAG_TDI) TP1166.P$1
N$57: J1006.X3_116(X3:JTAG_TDO) TP1165.P$1
N$58: R1103.1 R1104.2 U1001.6(ON_OFF/)
N$59: TP1008.P$1 U1001.5(PGOOD/)
N$60: U1009.3(!2Q) U1009.6(2D) U1010.14(CKA)
N$61: U1010.1(CKB) U1010.12(QA)
N$62: D1001.CATHODE R1023.1 R1024.2 U1008.5(AB)
N$63: LED1004.A R1030.2
N$64: TP1003.P$1 U1000.L7(COMP1)
N$65: TP1000.P$1 U1000.J8(FREQ/PLLFLTR)
N$66: TP1007.P$1 U1000.J5(RUN2)
N$67: TP1005.P$1 U1000.L6(COMP2)
N$68: LED1005.A R1031.2
N$69: LED1006.A R1032.2
N$70: LED1007.A R1033.2
N$71: LED1008.A R1034.2
N$72: LED1009.A R1035.2
N$73: LED1010.A R1036.2
N$74: LED1002.4(B:A) R1039.1
N$75: LED1002.1(R:A) R1037.1
N$76: J1006.X3_88(X3:!SEL_B0) TP1117.P$1
N$77: J1006.X3_87(X3:SEL_B1) TP1121.P$1
N$78: J1006.X3_89(X3:SEL_B2) TP1124.P$1
N$79: J1006.X3_92(X3:!SEL_B3) TP1127.P$1
N$80: J1006.X3_83(X3:!HRESETF) TP1109.P$1
N$81: J1006.X3_81(X3:!WP/!ACC) TP1105.P$1
N$82: LED1002.3(G:A) R1038.1
N$83: LED1002.5(B:K) Q1005.3(D)
N$84: J1006.X3_86(X3:VBATT3V3) TP1096.P$1
N$85: J1006.X3_77(X3:SDA_2) TP1080.P$1
N$86: J1006.X3_79(X3:SDA_1) TP1076.P$1
N$87: J1006.X3_78(X3:SCL_2) TP1072.P$1
N$88: J1006.X3_80(X3:SCL_1) TP1069.P$1
N$89: J1006.X3_76(X3:RS232_TXD_2) TP1060.P$1
N$90: LED1002.2(G:K) Q1004.3(D)
N$91: J1006.X3_75(X3:RS232_RXD_2) TP1054.P$1
N$92: LED1002.6(R:K) Q1003.3(D)
N$93: J1006.X3_67(X3:PSC6_3) TP1044.P$1
N$94: J1006.X3_68(X3:PSC6_2) TP1041.P$1
N$95: J1006.X3_69(X3:PSC6_1) TP1038.P$1
N$96: J1006.X3_70(X3:PSC6_0) TP1035.P$1
N$97: J1006.X3_62(X3:PSC1_4) TP1028.P$1
N$98: J1006.X3_59(X3:PSC1_3) TP1025.P$1
N$99: J1006.X3_64(X3:PSC1_2) TP1021.P$1
N$100: Q1006.3(D) R1046.2
N$101: R1035.1 U1012.5(B:Y3)
N$102: TP1228.P$1 X1000.34(!PDIAG)
N$103: R1036.1 U1012.3(B:Y4)
N$104: R1029.1 U1012.18(A:Y1)
N$105: R1030.1 U1012.16(A:Y2)
N$106: J1006.X3_28(X3:USB1_6) TP1083.P$1
N$107: J1006.X3_29(X3:USB1_9) TP1091.P$1
N$108: J1006.X3_36(X3:TIMER_2) TP1104.P$1
N$109: J1006.X3_33(X3:TIMER_3) TP1108.P$1
N$110: J1006.X3_38(X3:TIMER_4) TP1111.P$1
N$111: J1006.X3_35(X3:TIMER_5) TP1113.P$1
N$112: J1006.X3_40(X3:TIMER_6) TP1116.P$1
N$113: J1006.X3_39(X3:TIMER_7) TP1120.P$1
N$114: R1031.1 U1012.14(A:Y3)
N$115: TP1227.P$1 X1000.32(RESERVED)
N$116: R1032.1 U1012.12(A:Y4)
N$117: R1098.1 X1000.31(INTRQ)
N$118: LED11011.A R1046.1
N$119: R1097.2 X1000.37(!CS0)
N$120: U1002.4(IN-) U1002.5(REF)
N$121: R1096.2 X1000.25(!HDMARDY)
N$122: R1047.1 X1000.1(!RESET)
N$124: J1006.X3_56(X3:PSC2_2) TP1162.P$1
N$125: J1006.X3_55(X3:PSC2_3) TP1163.P$1
N$126: J1006.X1_53(X1:EXT_AD_31) TP1015.P$1
N$127: J1006.X1_52(X1:EXT_AD_30) TP1019.P$1
N$128: J1006.X1_55(X1:EXT_AD_29) TP1023.P$1
N$129: J1006.X1_54(X1:EXT_AD_28) TP1027.P$1
N$130: J1006.X1_57(X1:EXT_AD_27) TP1030.P$1
N$131: J1006.X1_56(X1:EXT_AD_26) TP1032.P$1
N$132: J1006.X1_59(X1:EXT_AD_25) TP1034.P$1
N$133: J1006.X1_60(X1:EXT_AD_24) TP1037.P$1
N$134: J1006.X1_63(X1:EXT_AD_23) TP1040.P$1
N$135: J1006.X1_62(X1:EXT_AD_22) TP1043.P$1
N$136: J1006.X1_65(X1:EXT_AD_21) TP1046.P$1
N$137: J1006.X1_64(X1:EXT_AD_20) TP1048.P$1
N$138: J1006.X1_67(X1:EXT_AD_19) TP1050.P$1
N$139: R1045.2 R1058.2 X1000.3(DD7)
N$140: J1006.X1_99(X1:ATA_ISOLATION) TP1129.P$1
N$141: J1006.X1_95(X1:!LP_ACK) TP1144.P$1
N$142: J1006.X1_93(X1:!LP_ALE) TP1146.P$1
N$143: Q1001.3(D) Q1002.3(D) R1003.1
N$146: J1006.X1_117(X1:START_L_H) TP1160.P$1
N$147: R1100.1 X1000.27(!DDMARDY)
N$163: R1055.1 X1000.21(DMARQ)
N$164: R1049.1 X1000.7(DD5)
N$165: R1054.1 X1000.17(DD0)
N$166: R1053.1 X1000.15(DD1)
N$167: R1052.1 X1000.13(DD2)
N$168: R1051.1 X1000.11(DD3)
N$169: R1050.1 X1000.9(DD4)
N$170: R1057.2 X1000.5(DD6)
N$171: R1059.2 X1000.4(DD8)
N$172: R1060.2 X1000.6(DD9)
N$173: R1061.2 X1000.8(DD10)
N$176: R1062.2 X1000.10(DD11)
N$177: R1063.2 X1000.12(DD12)
N$178: R1064.2 X1000.14(DD13)
N$179: J1006.X1_111(X1:!LP_CS3) TP1156.P$1
N$180: J1006.X1_112(X1:!LP_CS2) TP1154.P$1
N$181: J1006.X1_113(X1:!LP_CS1) TP1151.P$1
N$182: J1006.X1_116(X1:!LP_CS0) TP1148.P$1
N$183: J1006.X1_39(X1:!PCI_GNT) TP1142.P$1
N$184: J1006.X1_32(X1:!PCI_TRDY) TP1140.P$1
N$185: J1006.X1_41(X1:!PCI_DEVSEL) TP1137.P$1
N$186: J1006.X1_48(X1:PCI_CLOCK) TP1134.P$1
N$187: J1006.X1_46(X1:!PCI_FRAME) TP1131.P$1
N$188: J1006.X1_44(X1:PCI_ID_SEL) TP1128.P$1
N$189: J1006.X1_35(X1:!PCI_IRDY) TP1125.P$1
N$190: J1006.X1_33(X1:!PCI_PERR) TP1122.P$1
N$191: J1006.X1_40(X1:PCI_PAR) TP1118.P$1
N$192: J1006.X1_38(X1:!PCI_REQ) TP1114.P$1
N$193: J1006.X1_36(X1:!PCI_SERR) TP1112.P$1
N$194: J1006.X1_31(X1:!PCI_RESET) TP1110.P$1
N$195: J1006.X1_29(X1:!PCI_STOP) TP1106.P$1
N$196: J1006.X1_43(X1:!PCI_CBE_3) TP1100.P$1
N$197: J1006.X1_45(X1:!PCI_CBE_2) TP1097.P$1
N$198: J1006.X1_47(X1:!PCI_CBE_1) TP1094.P$1
N$199: J1006.X1_51(X1:!PCI_CBE_0) TP1092.P$1
N$200: J1006.X1_23(X1:IRQ3) TP1084.P$1
N$201: J1006.X1_28(X1:IRQ2) TP1081.P$1
N$202: J1006.X1_27(X1:IRQ1) TP1077.P$1
N$203: J1006.X1_30(X1:IRQ0) TP1073.P$1
N$213: R1019.1 U1006.12(D+)
N$214: R1020.1 U1006.11(D-)
N$215: R1065.2 X1000.16(DD14)
N$216: R1066.2 X1000.18(DD15)
N$217: R1099.1 X1000.29(!DMACK)
N$219: R1094.2 X1000.33(DA1)
N$220: R1095.2 X1000.35(DA0)
N$224: R1067.2 X1000.36(DA2)
N$225: R1068.2 X1000.38(!CS1)
N$229: R1056.1 X1000.23(STOP)
N_GATE: C1013.2 Q1001.1(G) U1003.1(OUT)
N_GATE1: C1011.2 Q1002.1(G) U1002.1(OUT)
P_GATE: Q1000.GATE(G) U1001.3(GATE)
PSC2_0: J1006.X3_60(X3:PSC2_0) TP1158.P$1 U1008.4(R)
PSC2_1: J1006.X3_57(X3:PSC2_1) TP1161.P$1 U1007.7(1A) U1008.1(D)
PWR: J1001.B+@1(B+) J1001.B+@2(B+) L1000.4
RCV: J1006.X3_47(X3:PSC3_3) U1005.4(RCV)
RS232_RXD_1: J1006.X3_71(X3:RS232_RXD_1) R1027.1 TP1051.P$1 U1011.6(A)
RS232_TXD_1: J1006.X3_72(X3:RS232_TXD_1) R1028.1 TP1057.P$1 U1011.4(B)
SH_GND: J1001.B-@1(B-) J1001.B-@2(B-) L1000.1
SLOPECONTROL: R1022.2 U1008.8(RS)
SM501_CLKOF: J1006.X2_4(X2:SM501_CLKOF) TP1167.P$1 U1009.1(1CLK)
SOFTCON: J1006.X3_65(X3:PSC1_0) U1005.2(SOFTCON)
SPEED: J1006.X3_43(X3:PSC3_7) U1005.10(SPEED)
SPS-500KHZ: R1026.1 U1000.H8(MODE/PLLIN) U1010.8(QD)
SUSPND: J1006.X3_44(X3:PSC3_8) U1005.7(SUSPND)
TEST_MODE0: J1003.9 J1006.X3_17(X3:TEST_MODE0)
TEST_MODE1: J1003.10 J1006.X3_15(X3:TEST_MODE1)
TEST_SEL_0: J1003.6 J1006.X3_16(X3:TEST_SEL_0)
TEST_SEL_1: J1003.7 J1006.X3_12(X3:TEST_SEL_1)
TLV-3V-VCC: C1010.2 D1003.CATHODE U1002.6(V+)
TLV-5V-VCC: C1012.2 D1004.CATHODE U1003.6(V+)
UART_RXD: C1033.2 J1001.AUX_1@1(AUX_1) J1001.AUX_1@2(AUX_1) R1027.2
UART_TXD: C1034.2 J1001.AUX_2@1(AUX_2) J1001.AUX_2@2(AUX_2) R1028.2
USB1_!OE: J1006.X3_20(X3:USB1_0) U1006.3(!OE)
USB1_D+: J1001.USB_H@1(USB_H) J1001.USB_H@2(USB_H) R1019.2 R1110.1
USB1_D-: J1001.USB_L@1(USB_L) J1001.USB_L@2(USB_L) R1020.2 R1109.1
USB1_RCV: J1006.X3_21(X3:USB1_3) U1006.4(RCV)
USB1_SOFTCON: J1006.X3_63(X3:PSC1_1) TP1017.P$1 U1006.2(SOFTCON)
USB1_SPEED: J1006.X3_27(X3:USB1_7) U1006.10(SPEED)
USB1_SUSPND: J1006.X3_30(X3:USB1_8) U1006.7(SUSPND)
USB1_VM: J1006.X3_23(X3:USB1_5) U1006.6(VM)
USB1_VMO: J1006.X3_19(X3:USB1_1) U1006.14(VMO)
USB1_VP: J1006.X3_24(X3:USB1_4) U1006.5(VP)
USB1_VPO: J1006.X3_22(X3:USB1_2) U1006.13(VPO)
USB2_D+: J1002.USB_H@3(USB_H) J1002.USB_H@4(USB_H) R1016.2 R1108.2
USB2_D-: J1002.USB_L@5(USB_L) J1002.USB_L@6(USB_L) R1017.2 R1107.2
VBUS: C1018.1 J1002.B+@1(5V) J1002.B+@2(5V) U1004.6(OUT)
VIN: C1003.1 C1004.1 R1002.2 R1003.2 U1000.J1(VIN) U1000.J2(VIN) U1000.J3(VIN) U1000.J10(VIN) U1000.J11(VIN) U1000.J12(VIN) U1000.K1(VIN) U1000.K2(VIN) U1000.K3(VIN) U1000.K4(VIN) U1000.K9(VIN) U1000.K10(VIN) U1000.K11(VIN) U1000.K12(VIN) U1000.L1(VIN) U1000.L2(VIN) U1000.L3(VIN) U1000.L4(VIN) U1000.L5(VIN) U1000.L8(VIN) U1000.L9(VIN) U1000.L10(VIN) U1000.L11(VIN) U1000.L12(VIN) U1000.M1(VIN) U1000.M2(VIN) U1000.M3(VIN) U1000.M4(VIN) U1000.M5(VIN) U1000.M6(VIN) U1000.M7(VIN) U1000.M8(VIN) U1000.M9(VIN) U1000.M10(VIN) U1000.M11(VIN) U1000.M12(VIN) U1001.2(DRAIN)
VM: J1006.X3_45(X3:PSC3_5) U1005.6(VM)
VMO: J1006.X3_51(X3:PSC3_1) U1005.14(VMO)
VP: J1006.X3_48(X3:PSC3_4) U1005.5(VP)
VPO: J1006.X3_52(X3:PSC3_2) U1005.13(VPO)
VS: C1005.+ C1006.2 F1000.2 Q1000.SOURCE(S) R1103.2 TVS1000.ANODE U1001.1(VS)
Unconnected: J1006.X1_94(X1:!LP_TS) J1006.X1_96(X1:!LP_OE) J1006.X1_115(X1:RESERVE19) J1006.X1_118(X1:RESERVE20) J1006.X2_3(X2:SM501_USB-) J1006.X2_5(X2:SM501_USB+) J1006.X2_20(X2:GPIO63) J1006.X2_21(X2:GPIO62) J1006.X2_23(X2:VDEN) J1006.X2_24(X2:FP_CLK) J1006.X2_26(X2:FP_EN) J1006.X2_27(X2:BIAS) J1006.X2_28(X2:FP_DISP) J1006.X2_29(X2:FP_HSYNC) J1006.X2_31(X2:FP_VSYNC) J1006.X2_32(X2:BLUE) J1006.X2_33(X2:HSYNC) J1006.X2_34(X2:GREEN) J1006.X2_35(X2:VSYNC) J1006.X2_36(X2:RED) J1006.X3_91(X3:RESERVE_1) J1006.X3_93(X3:RESERVE_3) J1006.X3_94(X3:RESERVE_2) J1006.X3_95(X3:RESERVE_5) J1006.X3_96(X3:RESERVE_4) J1006.X3_99(X3:RESERVE_7) J1006.X3_100(X3:RESERVE_6) J1006.X3_101(X3:RESERVE_9) J1006.X3_102(X3:RESERVE_8) J1006.X3_103(X3:RESERVE_11) J1006.X3_104(X3:RESERVE_10) J1006.X3_105(X3:RESERVE_12) J1006.X3_107(X3:RESERVE_13) J1006.X3_108(X3:RESERVE_14) J1006.X3_110(X3:RESERVE_16) J1006.X3_111(X3:RESERVE_15) J1006.X3_112(X3:RESERVE_18) J1006.X3_113(X3:RESERVE_17) MT1.MT MT2.MT MT3.MT MT4.MT MT5.MT MT6.MT U1005.1(VPU) U1006.1(VPU) U1010.2(NC) U1010.3(NC) U1010.4(NC) U1010.13(NC) X1000.20(KEYPIN) X1000.44(NC)

## Buses
CPU_JTAG_TDO,CPU_JTAG_TMS,CPU_JTAG_TDI,!JCPU_JTAG_TRST,TEST_SEL_[0..1],CPU_JTAG_TCK,TEST_MODE[0..1],!HRESET,!SRESET,!PO_RESET,!RESIN
EXT_AD[0..18]
VM,VP,VPO,VMO,RCV,SUSPND,SOFTCON,SPEED,!OE,EN,!FAULT
!LP_CS4,!LP_CS5,!ATA_IOR,ATA_INTRQ,!ATA_DACK,!ATA_IOW,ATA_IOCHRDY,ATA_DRQ,!ATA_RESET

## Notes on the sheet
- Rcb
- 1%
- 1%
- 1%
- 1%
- 24 MHz
- Stuck
- Dominant Bit
- Timer
- 18k = 10V/uS
- OPTIONAL
- 60 OHM

## Library data of the parts
C1000 C1002-C1004 C1006 C1007 C1009-C1013 C1018-C1021 C1028-C1036 C1039-C1046 = rcl_custom:C-EU: CAPACITOR, European symbol
C1001 C1008 C1017 C1038 = rcl:CPOL-EU: POLARIZED CAPACITOR, European symbol
C1005 = rcl:CPOL-US: POLARIZED CAPACITOR, American symbol
D1000 D1001 D1003 D1004 = diode-0603:DIODE-0603
F1000 = custom:FUSE: Fuse
J1001 = rocketbus:ROCKETBUS
J1002 = usb-connector:PSAS-USB-CONNECTOR
J1003 = con-molex:87758-1616: 16 Pin - 2mm Dual Row Single Wafer, Vertical T/H HDR Source: http://www.molex.com/pdm_docs/sd/877580616_sd.pdf
J1006 = tqm:TQM
J1007 J1008 = 1_10_CON:1_10_CON
L1000 = choke:COIL_CMS1: Coiltronics CMS1 series common mode choke
LED1002 = Tova:LED_RGB_*: RGB LED with separate contacts for all 3 chips
LED1003-LED1010 LED11011 = led:LED: LED OSRAM: - CHIPLED LG R971, LG N971, LY N971, LG Q971, LY Q971, LO R971, LY R971 LH N974, LH R974 LS Q976, LO Q976, LY Q976 LO Q996 - Hyper CHIPLED LW Q18S LB Q993, LB Q99A, LB R99A - SideLED LS A670, LO A670, LY A670, LG A670, LP A670 LB A673, LV A673, LT A673, LW A673 LH A674 LY A675 LS A676, LA A676, LO A676, LY A676, LW A676 LS A679, LY A679, LG A679 - Hyper Micro SIDELED® LS Y876, LA Y876, LO Y876, LY Y876 LT Y87S - SmartLED LW L88C, LW L88S LB L89C, LB L89S, LG L890 LS L89K, LO L89K, LY L89K LS L896, LA L896, LO L896, LY L896 - TOPLED LS T670, LO T670, LY T670, LG T670, LP T670 LSG T670, LSP T670, LSY T670, LOP T670, LYG T670 LG T671, LOG T671, LSG T671 LB T673, LV T673, LT T673, LW T673 LH T674 LS T676, LA T676, LO T676, LY T676, LB T676, LH T676, LSB T676, LW T676 LB T67C, LV T67C, LT T67C, LS T67K, LO T67K, LY T67K, LW E67C LS E67B, LA E67B, LO E67B, LY E67B, LB E67C, LV E67C, LT E67C LW T67C LS T679, LY T679, LG T679 LS T770, LO T770, LY T770, LG T770, LP T770 LB T773, LV T773, LT T773, LW T773 LH T774 LS E675, LA E675, LY E675, LS T675 LS T776, LA T776, LO T776, LY T776, LB T776 LHGB T686 LT T68C, LB T68C - Hyper Mini TOPLED® LB M676 - Mini TOPLED Santana® LG M470 LS M47K, LO M47K, LY M47K Source: http://www.osram.convergy.de LUXEON: - LUMILED® LXK2-PW12-R00, LXK2-PW12-S00, LXK2-PW14-U00, LXK2-PW14-V00 LXK2-PM12-R00, LXK2-PM12-S00, LXK2-PM14-U00 LXK2-PE12-Q00, LXK2-PE12-R00, LXK2-PE12-S00, LXK2-PE14-T00, LXK2-PE14-U00 LXK2-PB12-K00, LXK2-PB12-L00, LXK2-PB12-M00, LXK2-PB14-N00, LXK2-PB14-P00, LXK2-PB14-Q00 LXK2-PR12-L00, LXK2-PR12-M00, LXK2-PR14-Q00, LXK2-PR14-R00 LXK2-PD12-Q00, LXK2-PD12-R00, LXK2-PD12-S00 LXK2-PH12-R00, LXK2-PH12-S00 LXK2-PL12-P00, LXK2-PL12-Q00, LXK2-PL12-R00 Source: www.luxeon.com KINGBRIGHT: KA-3528ASYC Source: www.kingbright.com
MT1-MT6 = mount:#4-PLATED_MOUNTING_HOLE: 1/8" drill hole for #4 screw mount
Q1000 = ZXMP6A17:ZXMP6A17
Q1001-Q1005 = Tova:PMV45EN
Q1006 = Tova:NTR4101P
R1000-R1008 R1012 R1013 R1015-R1017 R1019-R1042 R1045-R1047 R1049-R1068 R1094-R1100 R1103-R1111 = rcl_custom:R-US_: RESISTOR, American symbol
TP1000-TP1005 TP1007-TP1011 TP1015 TP1017 TP1019 TP1021 TP1023 TP1025 TP1027 TP1028 TP1030 TP1032 TP1034 TP1035 TP1037 TP1038 TP1040 TP1041 TP1043 TP1044 TP1046 TP1048 TP1050 TP1051 TP1054 TP1057 TP1060 TP1069 TP1072 TP1073 TP1076 TP1077 TP1080 TP1081 TP1083 TP1084 TP1089 TP1091 TP1092 TP1094 TP1096 TP1097 TP1099 TP1100 TP1102 TP1104-TP1106 TP1108-TP1114 TP1116-TP1118 TP1120-TP1122 TP1124 TP1125 TP1127-TP1129 TP1131 TP1134 TP1137 TP1140 TP1142 TP1144 TP1146 TP1148 TP1151 TP1152 TP1154 TP1156 TP1158 TP1160-TP1163 TP1165-TP1167 TP1169 TP1171 TP1179 TP1181 TP1183 TP1184 TP1186 TP1187 TP1189 TP1190 TP1192-TP1194 TP1196 TP1199 TP1202 TP1205 TP1208 TP1210 TP1212 TP1214 TP1216-TP1235 = tqm:TEST
TVS1000 = tvs-0603:TVS-0603
U1000 = LT4619:LT4619
U1001 = node4:IC_MAX5902: MAX5902 Hot swap controller
U1002 U1003 = node4:IC_TLV3012: TLV3012 Nano power comparator with voltage reference
U1004 = usb power switch:TPS2552: TSP2552 Precision adjustable current-limited power distribution switch
U1005 U1006 = TUSB1106:TUSB1106: TUSB1106 Advance universal serial bus transceiver
U1007 = 0kaz:IC_NC7NP14: Triple Inverter with Schmitt Trigger Input FairchildSemi http://www.fairchildsemi.com/ds/NC%2FNC7NP14.pdf
U1008 = can-transceiver:SN65HVD235
U1009 = sn74lvc2g80:SN74LVC2G80
U1010 = SN74LS92:SN74LS92D
U1011 = sn65220:SN65220
U1012 = 74xx-us:74*244: Octal BUFFER and LINE DRIVER, 3-state
X1000 = IDE_CON:IDE_CON_D: IDE CON 4 Pin - 2mm Dual Row Single Wafer, Vertical T/H HDR